# EAGLE design mpubreakout (EAGLE 6.4)
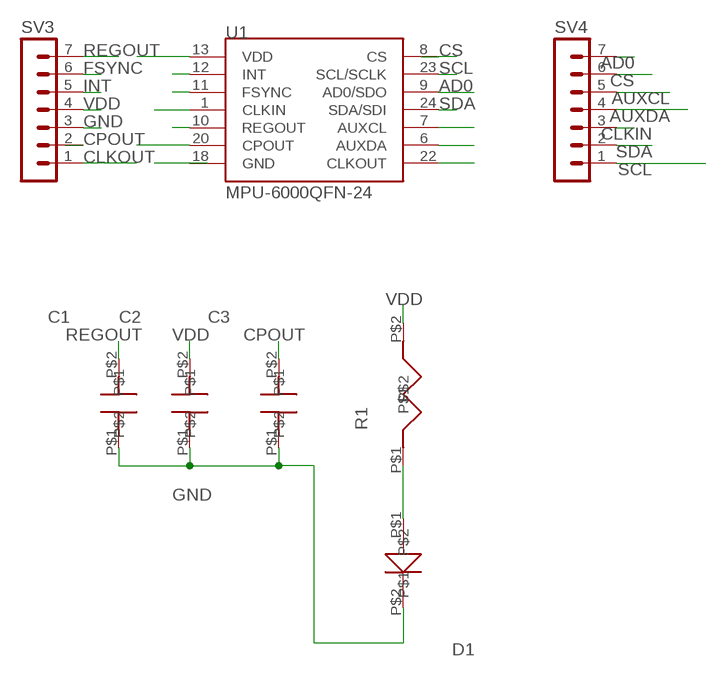
[diagram p0: schematic, sheet 1]

## Parts
C1  CAPACITOR-.1UF-4V  [0603-CAPACITOR]
C2  CAPACITOR-.1UF-4V  [0603-CAPACITOR]
C3  CAPACITOR-2.2NF-50V  [0603-CAPACITOR]
D1  RED_LED  [0603-CAPACITOR]
R1  RESISTOR-4.7K-25V  [0603-CAPACITOR]
SV3  MA07-1  [MA07-1]
SV4  MA07-1  [MA07-1]
U1  MPU-6000QFN-24  [QFN-24-TESTING]

## Nets
AD0: SV4.7 U1.9(AD0/SDO)
AUXCL: SV4.5 U1.7(AUXCL)
AUXDA: SV4.4 U1.6(AUXDA)
CLKIN: SV4.3 U1.1(CLKIN)
CLKOUT: SV3.1 U1.22(CLKOUT)
CPOUT: C3.P$2 SV3.2 U1.20(CPOUT)
CS: SV4.6 U1.8(CS)
FSYNC: SV3.6 U1.11(FSYNC)
GND: C1.P$1 C2.P$1 C3.P$1 D1.P$2 SV3.3 U1.18(GND)
INT: SV3.5 U1.12(INT)
N$1: D1.P$1 R1.P$1
REGOUT: C1.P$2 SV3.7 U1.10(REGOUT)
SCL: SV4.1 U1.23(SCL/SCLK)
SDA: SV4.2 U1.24(SDA/SDI)
VDD: C2.P$2 R1.P$2 SV3.4 U1.13(VDD)

## Library data of the parts
C1 C2 = aerial:CAPACITOR-.1UF-4V
C3 = aerial:CAPACITOR-2.2NF-50V
D1 = aerial:RED_LED
R1 = aerial:RESISTOR-4.7K-25V
SV3 SV4 = con-lstb:MA07-1: PIN HEADER; OC_FARNELL: unknown; OC_NEWARK: unknown
U1 = SparkFun-Sensors:MPU-6000: MPU-6000 - I2C address is 0x68 with AD0 low and 0x69 with AD0 high.

## Board
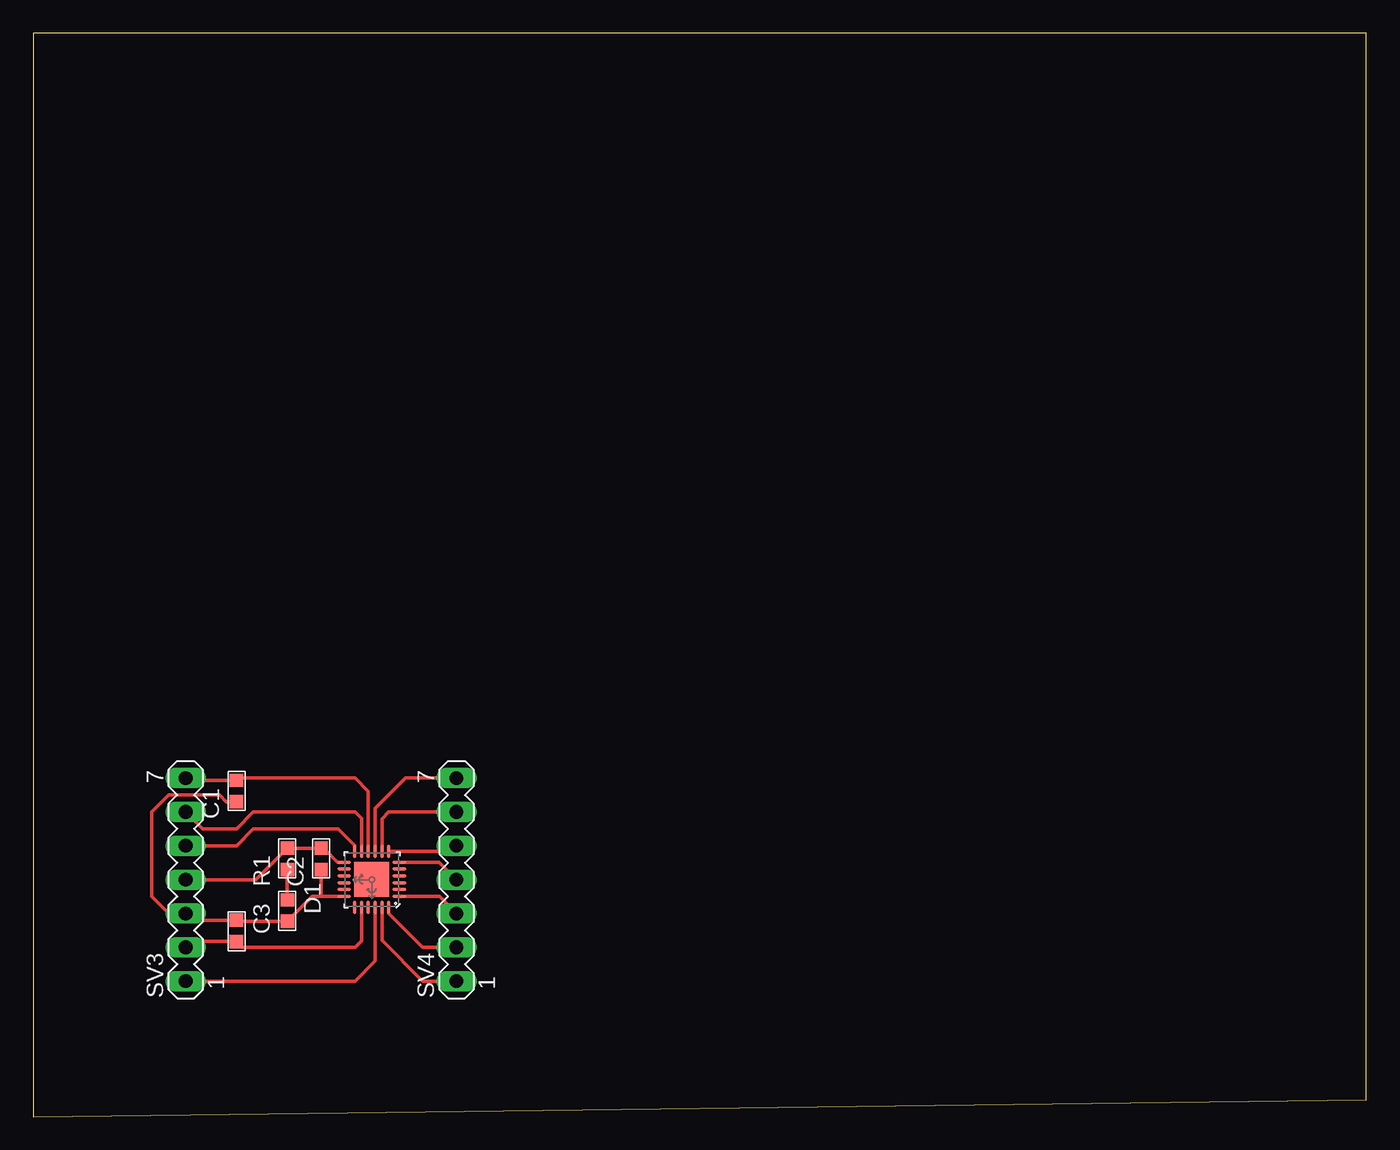
[diagram p1: board, top side]
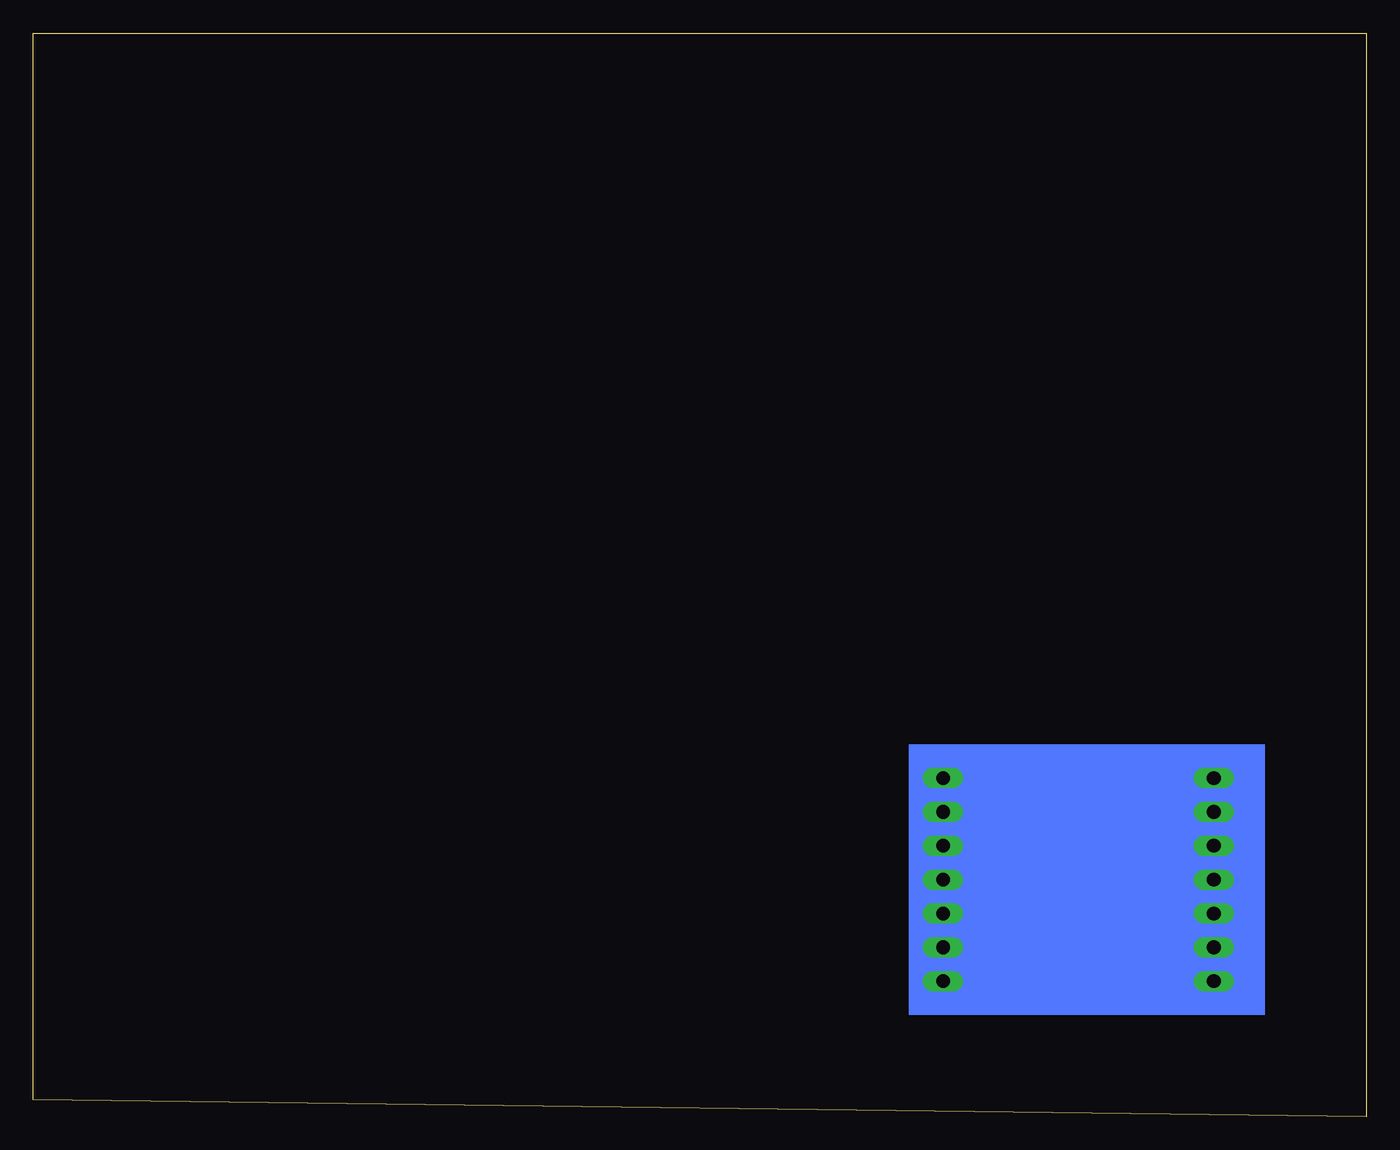
[diagram p2: board, bottom side, seen from below]

Size 100 x 81.28 mm. Coordinates in mm from the lower left corner, seen from the top.
Outline: 0,0 100,1.27 100,81.27 0.01,81.28 0,0
Copper layers (1*16): Top 0.035mm / dielectric 1.5mm / Bottom 0.035mm
Design rules "default": minimum track width 10mil, minimum drill 24mil, track to track 8mil, track to pad 8mil, pad to pad 8mil, via to via 8mil, smd to smd 8mil, copper to edge 40mil, drill to drill 8mil, minimum pad ring 10mil, minimum via ring 8mil, stop-mask expansion 4mil, vias tented up to drill 0mil, thermal gap 10mil

### Footprints (pad centres in the part's own frame; a part is rotated, then mirrored left to right if it is on the bottom)
0603-CAPACITOR = smd 1 x 1: P$1 0,0; P$2 1.6,0
MA07-1 = drill 1.016 long: 1 -7.62,0; 2 -5.08,0; 3 -2.54,0; 4 0,0; 5 2.54,0; 6 5.08,0; 7 7.62,0
QFN-24-TESTING = smd 1.016 x 0.254: 1 -2.066,1.257; 2 -2.066,0.75; 3 -2.066,0.247; 4 -2.066,-0.287; 5 -2.066,-0.792; 6 -2.066,-1.297; 13 2.086,-1.297; 14 2.086,-0.792; 15 2.086,-0.287; 16 2.086,0.247; 17 2.086,0.75; 18 2.086,1.257 | smd 0.254 x 1.016: 7 -1.267,-2.122; 8 -0.762,-2.122; 9 -0.258,-2.122; 10 0.278,-2.122; 11 0.78,-2.122; 12 1.287,-2.122; 19 1.287,2.082; 20 0.78,2.082; 21 0.278,2.082; 22 -0.258,2.082; 23 -0.762,2.082; 24 -1.267,2.082 | smd 2.616 x 2.616: P$1 0.02,-0.01

### Placement (x,y rotation side)
C1  15.24,23.62 90 top
C2  21.59,18.54 90 top
C3  15.24,14.73 270 top
D1  19.05,16.26 270 top
R1  19.05,18.54 90 top
SV3  11.43,17.78 90 top
SV4  31.75,17.78 90 top
U1  25.4,17.78 180 top

### Tracks (layer width: path | path; a pad name or v marks a point on that pad's centre or on a via)
AD0
  Top 0.254: U1.9 25.66,23.12 27.94,25.4 SV4.7
AUXCL
  Top 0.254: U1.7 31.33,19.9 SV4.5
AUXDA
  Top 0.254: U1.6 30.45,19.08 SV4.4
CLKIN
  Top 0.254: U1.1 30.47,16.52 SV4.3
CLKOUT
  Top 0.254: U1.22 25.66,11.69 24.13,10.16 SV3.1
CPOUT
  Top 0.254: U1.20 24.62,13.19 24.13,12.7 15.67,12.7 C3.P$2 11.86,13.13 SV3.2
CS
  Top 0.254: U1.8 26.16,22.35 26.67,22.86 SV4.6
FSYNC
  Top 0.254: U1.11 24.62,22.37 24.13,22.86 16.51,22.86 15.24,21.59 12.7,21.59 SV3.6
GND
  Top 0.254: C1.P$1 14.48,23.62 13.97,24.13 10.16,24.13 8.89,22.86 8.89,16.51 10.16,15.24 SV3.3 11.94,14.73 C3.P$1 15.32,14.66 D1.P$2 20.92,16.52 21.59,16.52 | 21.59,16.52 U1.18 | C2.P$1 21.59,16.52
INT
  Top 0.254: U1.12 24.11,20.34 22.86,21.59 16.51,21.59 15.24,20.32 SV3.5
N$1
  Top 0.254: D1.P$1 R1.P$1
REGOUT
  Top 0.254: U1.10 25.12,24.41 24.13,25.4 15.42,25.4 C1.P$2 11.61,25.22 SV3.7
SCL
  Top 0.254: U1.23 26.16,13.21 29.21,10.16 SV4.1
SDA
  Top 0.254: U1.24 26.67,15.24 29.21,12.7 SV4.2
VDD
  Top 0.254: U1.13 22.83,19.08 21.77,20.14 C2.P$2 R1.P$2 16.69,17.78 SV3.4
(copper drawn outside any net)
  shapes: Bottom area x1